# Altium schematic sheet 8051.SchDoc
size A4
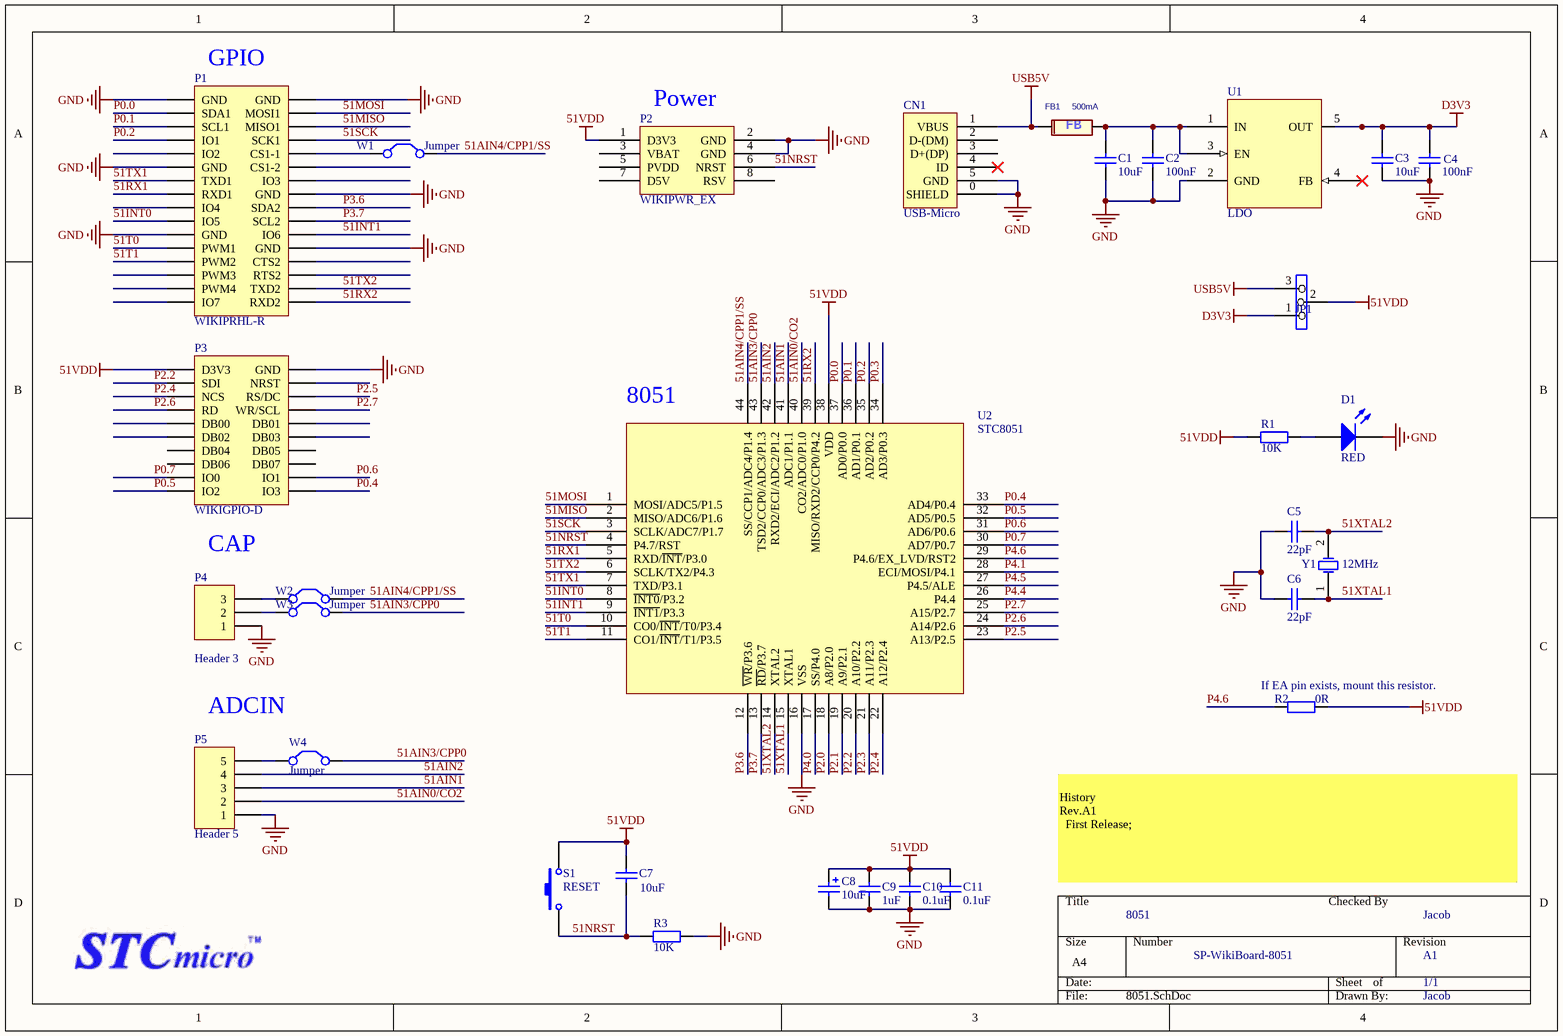
[diagram p0: 8051.SchDoc]

## Parts
C1  10uF  [C0805]
C2  100nF  [C0603L]
C3  10uF  [C0805]
C4  100nF  [C0603L]
C5  22pF  [C0603L]
C6  22pF  [C0603L]
C7  10uF  [C0805]
C8  10uF  [TAJ-A]
C9  1uF  [C0603L]
C10  0.1uF  [C0603L]
C11  0.1uF  [C0603L]
CN1  USB-Micro  [USB_MICRO_5S_B]
D1  RED  [SMT_LED_0603]
FB1  500mA  [R1206]
JP1  JP3  [SIP3]  (value not drawn)
P1  WIKIPRHL-R  [WIKIPRHL-R]
P2  WIKIPWR_EX  [WIKIPWR_EX]
P3  WIKIGPIO-D  [WIKIGPIO-D]
P4  Header 3  [HDR1X3/2.54mm]
P5  Header 5  [HDR1X5/2.54MM]
R1  10K  [R0603]
R2  0R  [R0603]
R3  10K  [R0603]
S1  RESET  [KEY-2x4-SMD]
U1  LDO  [SOT23-5]
U2  STC8051  [TQFP44]
W1  Jumper  [Solderbridge]
W2  Jumper  [Solderbridge]
W3  Jumper  [Solderbridge]
W4  Jumper  [Solderbridge]
Y1  12MHz  [XTAL0602]

## Nets
51VDD: C7.2 C8.1 C9.2 C10.2 C11.2 JP1.2 P2.1(D3V3) P3.1(D3V3) R1.2 R2.2 S1.2 U2.38(VDD)
D3V3: C3.1 C4.1 JP1.1 U1.5(OUT)
GND: C1.2 C2.2 C3.2 C4.2 C5.1 C6.1 C8.2 C9.1 C10.1 C11.1 CN1.0(SHIELD) CN1.5(GND) D1.2(K) P1.1(GND) P1.2(GND) P1.11(GND) P1.16(GND) P1.21(GND) P1.24(GND) P2.2(GND) P2.4(GND) P3.2(GND) P4.1 P5.1 R3.1 U1.2(GND) U2.16(VSS)
USB5V: CN1.1(VBUS) FB1.1 JP1.3
51AIN0/CO2: P5.2 U2.40(CO2/ADC0/P1.0)
51AIN1: P5.3 U2.41(ADC1/P1.1)
51AIN2: P5.4 U2.42(RXD2/ECI/ADC2/P1.2)
51AIN3/CPP0: U2.43(TSD2/CCP0/ADC3/P1.3) W3.2(C2) W4.2(C2)
51AIN4/CPP1/SS: U2.44(SS/CCP1/ADC4/P1.4) W1.1(C1) W2.2(C2)
51INT0: P1.19(IO5) U2.8(~{INT0}/P3.2)
51INT1: P1.22(IO6) U2.9(~{INT1}/P3.3)
51MISO: P1.6(MISO1) U2.2(MISO/ADC6/P1.6)
51MOSI: P1.4(MOSI1) U2.1(MOSI/ADC5/P1.5)
51NRST: C7.1 P2.6(NRST) R3.2 S1.1 U2.4(P4.7/RST)
51RX1: P1.15(RXD1) U2.5(RXD/~{INT}/P3.0)
51RX2: P1.32(RXD2) U2.39(MISO/RXD2/CCP0/P4.2)
51SCK: P1.8(SCK1) U2.3(SCLK/ADC7/P1.7)
51T0: P1.23(PWM1) U2.10(CO0/~{INT}/T0/P3.4)
51T1: P1.25(PWM2) U2.11(CO1/~{INT}/T1/P3.5)
51TX1: P1.13(TXD1) U2.7(TXD/P3.1)
51TX2: P1.30(TXD2) U2.6(SCLK/TX2/P4.3)
51XTAL1: C6.2 U2.15(XTAL1) Y1.1(OSC1)
51XTAL2: C5.2 U2.14(XTAL2) Y1.2(OSC2)
P0.0: P1.3(SDA1) U2.37(AD0/P0.0)
P0.1: P1.5(SCL1) U2.36(AD1/P0.1)
P0.2: P1.7(IO1) U2.35(AD2/P0.2)
P0.3: U2.34(AD3/P0.3)
P0.4: P3.20(IO3) U2.33(AD4/P0.4)
P0.5: P3.19(IO2) U2.32(AD5/P0.5)
P0.6: P3.18(IO1) U2.31(AD6/P0.6)
P0.7: P3.17(IO0) U2.30(AD7/P0.7)
P2.0: U2.18(A8/P2.0)
P2.1: U2.19(A9/P2.1)
P2.2: P3.3(SDI) U2.20(A10/P2.2)
P2.3: U2.21(A11/P2.3)
P2.4: P3.5(NCS) U2.22(A12/P2.4)
P2.5: P3.6(RS/DC) U2.23(A13/P2.5)
P2.6: P3.7(RD) U2.24(A14/P2.6)
P2.7: P3.8(WR/SCL) U2.25(A15/P2.7)
P3.6: P1.18(SDA2) U2.12(~{WR}/P3.6)
P3.7: P1.20(SCL2) U2.13(~{RD}/P3.7)
P4.0: U2.17(SS/P4.0)
P4.1: U2.28(ECI/MOSI/P4.1)
P4.4: U2.26(P4.4)
P4.5: U2.27(P4.5/ALE)
P4.6: R2.1 U2.29(P4.6/EX_LVD/RST2)
NetC1_1: C1.1 C2.1 FB1.2 U1.1(IN) U1.3(EN)
NetD1_1: D1.1(A) R1.1
NetP1_10: P1.10(CS1-1) W1.2(C2)
NetP4_2: P4.2 W3.1(C1)
NetP4_3: P4.3 W2.1(C1)
NetP5_5: P5.5 W4.1(C1)

Not connected (* = marked no-connect by the designer): CN1 2(D-(DM)) 3(D+(DP)) 4(ID)*; P1 9(IO2) 12(CS1-2) 14(IO3) 17(IO4) 26(CTS2) 27(PWM3) 28(RTS2) 29(PWM4) 31(IO7); P2 3(VBAT) 5(PVDD) 7(D5V) 8(RSV); P3 4(NRST) 9(DB00) 10(DB01) 11(DB02) 12(DB03) 13(DB04) 14(DB05) 15(DB06) 16(DB07); U1 4(FB)*

## Notes on the sheet
- (near P1) GPIO
- (near P2) Power
- (near U2) 8051
- CAP
- ADCIN
- (near R2) If EA pin exists, mount this resistor.
- History
  Rev.A1
  First Release;
- 8051
- Checked By
- Jacob
- SP-WikiBoard-8051
- A1
- 1/1

## Library data of the parts
C1-C7 C9-C11 = Cap: Capacitor; Published: 8-Jun-2000; LatestRevisionDate: 17-Jul-2002; LatestRevisionNote: Re-released for DXP Platform.; PackageReference: RAD-0.3; Publisher: Altium Limited
  C1 C3 C7: Value: 10uF
  C2 C4: Value: 100nF
  C5 C6: Value: 22pF
  C9: Value: 1uF
  C10 C11: Value: 0.1uF
C8 = Cap Pol1: Polarized Capacitor (Radial); Published: 8-Jun-2000; LatestRevisionDate: 17-Jul-2002; LatestRevisionNote: Re-released for DXP Platform.; PackageReference: RB7.6-15; Publisher: Altium Limited; Value: 10uF
D1 = LED0: Typical INFRARED GaAs LED; Published: 8-Jun-2000; LatestRevisionDate: 08-Jul-2005; LatestRevisionNote: Mech Layer 1 removed.; PackageReference: LED-0; Publisher: Altium Limited
FB1 = FB: Ferrite Beads Inductors Impedance:120Ω±25% Rated Current:1500mA DC Resistance:0.095Ω; Manufacturer: muRata; Manufacturer Part Number: BLM15EG121SN1
P1 = WIKIPRHL-R: Header, 16-Pin, Dual row; LatestRevisionDate: 17-Jul-2002; LatestRevisionNote: Re-released for DXP Platform.; Publisher: Altium Limited
P2 = WIKIPWR_EX: PWR HDR
P3 = WIKIGPIO-D: Header, 9-Pin, Dual row; LatestRevisionDate: 17-Jul-2002; LatestRevisionNote: Re-released for DXP Platform.; Publisher: Altium Limited
P4 = Header 3: Header, 3-Pin; LatestRevisionDate: 17-Jul-2002; LatestRevisionNote: Re-released for DXP Platform.; Publisher: Altium Limited
P5 = Header 5: Header, 5-Pin; LatestRevisionDate: 17-Jul-2002; LatestRevisionNote: Re-released for DXP Platform.; Publisher: Altium Limited
R1-R3 = Res2: Resistor; Published: 8-Jun-2000; LatestRevisionDate: 17-Jul-2002; LatestRevisionNote: Re-released for DXP Platform.; PackageReference: AXIAL-0.4; Publisher: Altium Limited
  R1 R3: Value: 10K
  R2: Value: 0R
S1 = SW-PB: Switch; Published: 24-Mar-1999; LatestRevisionDate: 17-Jul-2002; LatestRevisionNote: Re-released for DXP Platform.; PackageReference: SPST-2; Publisher: Altium Limited
U1 = LDO-SOT23-5: General LDO SOT23-5
U2 = STC12LE5A
W1-W4 = Jumper: Jumper Wire; Published: 24-Mar-1999; LatestRevisionDate: 17-Jul-2002; LatestRevisionNote: Re-released for DXP Platform.; PackageReference: RAD-0.2; Publisher: Altium Limited
Y1 = XTAL: Crystal Oscillator; Published: 8-Jun-2000; LatestRevisionDate: 17-Jul-2002; LatestRevisionNote: Re-released for DXP Platform.; PackageReference: R38; Publisher: Altium Limited